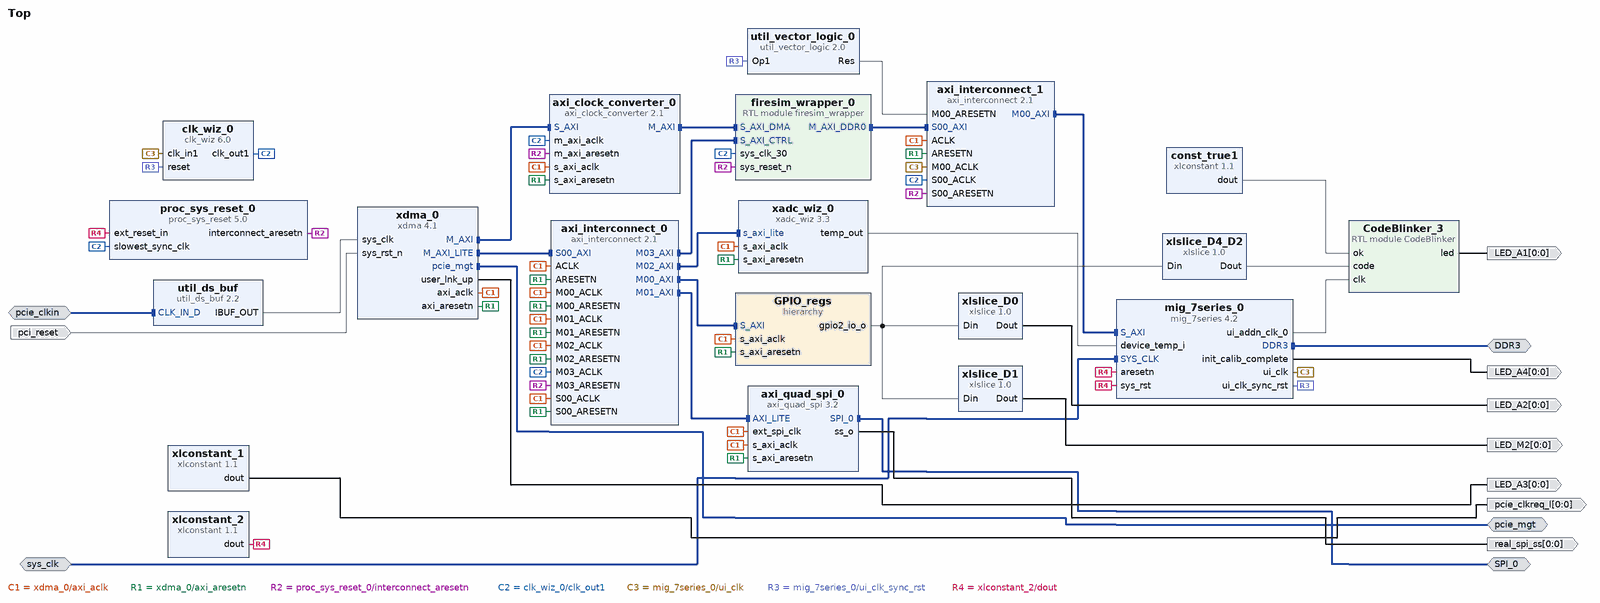
[diagram p0: block diagram of the top level]
# Vivado block design Top, xc7a100tfgg484-2L, Vivado 2023.1
create_bd_design Top

create_bd_intf_port -mode Master -vlnv xilinx.com:interface:ddrx_rtl:1.0 DDR3
create_bd_intf_port -mode Master -vlnv xilinx.com:interface:spi_rtl:1.0 SPI_0
create_bd_intf_port -mode Slave -vlnv xilinx.com:interface:diff_clock_rtl:1.0 pcie_clkin
set_property -dict {CONFIG.FREQ_HZ 100000000} [get_bd_intf_ports pcie_clkin]
create_bd_intf_port -mode Master -vlnv xilinx.com:interface:pcie_7x_mgt_rtl:1.0 pcie_mgt
create_bd_intf_port -mode Slave -vlnv xilinx.com:interface:diff_clock_rtl:1.0 sys_clk
set_property -dict {CONFIG.FREQ_HZ 100000000} [get_bd_intf_ports sys_clk]
create_bd_port -dir O -from 0 -to 0 LED_A4
create_bd_port -dir O -from 0 -to 0 LED_A3
create_bd_port -dir O -from 0 -to 0 real_spi_ss
create_bd_port -dir O -from 0 -to 0 LED_A2
create_bd_port -dir O -from 0 -to 0 LED_A1
create_bd_port -dir I -type rst pci_reset
set_property -dict {CONFIG.POLARITY ACTIVE_LOW} [get_bd_ports pci_reset]
create_bd_port -dir O -from 0 -to 0 pcie_clkreq_l
create_bd_port -dir O -from 0 -to 0 LED_M2

create_bd_cell -type hier GPIO_regs
create_bd_cell -type ip -vlnv xilinx.com:ip:mig_7series:4.2 mig_7series_0
set_property -dict [list \
  CONFIG.BOARD_MIG_PARAM Custom \
  CONFIG.RESET_BOARD_INTERFACE Custom \
  CONFIG.XML_INPUT_FILE mig_b.prj \
] [get_bd_cells mig_7series_0]
create_bd_cell -type ip -vlnv xilinx.com:ip:xlconstant:1.1 xlconstant_1
set_property -dict {CONFIG.CONST_VAL 0} [get_bd_cells xlconstant_1]
create_bd_cell -type ip -vlnv xilinx.com:ip:xlconstant:1.1 xlconstant_2
create_bd_cell -type ip -vlnv xilinx.com:ip:xlslice:1.0 xlslice_D1
set_property -dict {CONFIG.DIN_FROM 1 CONFIG.DIN_TO 1 CONFIG.DIN_WIDTH 32 CONFIG.DOUT_WIDTH 1} [get_bd_cells xlslice_D1]
create_bd_cell -type ip -vlnv xilinx.com:ip:xadc_wiz:3.3 xadc_wiz_0
set_property -dict [list \
  CONFIG.ADC_CONVERSION_RATE 1000 \
  CONFIG.DCLK_FREQUENCY 125 \
  CONFIG.ENABLE_RESET false \
  CONFIG.ENABLE_TEMP_BUS true \
  CONFIG.INTERFACE_SELECTION Enable_AXI \
] [get_bd_cells xadc_wiz_0]
create_bd_cell -type ip -vlnv xilinx.com:ip:util_vector_logic:2.0 util_vector_logic_0
set_property -dict {CONFIG.C_OPERATION not CONFIG.C_SIZE 1} [get_bd_cells util_vector_logic_0]
create_bd_cell -type ip -vlnv xilinx.com:ip:xlconstant:1.1 const_true1
create_bd_cell -type module -reference CodeBlinker CodeBlinker_3
create_bd_cell -type ip -vlnv xilinx.com:ip:xlslice:1.0 xlslice_D0
set_property -dict {CONFIG.DIN_FROM 0 CONFIG.DIN_TO 0 CONFIG.DIN_WIDTH 32 CONFIG.DOUT_WIDTH 1} [get_bd_cells xlslice_D0]
create_bd_cell -type ip -vlnv xilinx.com:ip:xlslice:1.0 xlslice_D4_D2
set_property -dict {CONFIG.DIN_FROM 4 CONFIG.DIN_TO 2 CONFIG.DIN_WIDTH 32 CONFIG.DOUT_WIDTH 3} [get_bd_cells xlslice_D4_D2]
create_bd_cell -type ip -vlnv xilinx.com:ip:axi_interconnect:2.1 axi_interconnect_0
set_property -dict {CONFIG.NUM_MI 4} [get_bd_cells axi_interconnect_0]
create_bd_cell -type ip -vlnv xilinx.com:ip:axi_interconnect:2.1 axi_interconnect_1
set_property -dict {CONFIG.ENABLE_ADVANCED_OPTIONS 0 CONFIG.NUM_MI 1} [get_bd_cells axi_interconnect_1]
create_bd_cell -type ip -vlnv xilinx.com:ip:axi_quad_spi:3.2 axi_quad_spi_0
set_property -dict {CONFIG.C_FIFO_DEPTH 256 CONFIG.C_SPI_MEMORY 3 CONFIG.C_SPI_MODE 2} [get_bd_cells axi_quad_spi_0]
create_bd_cell -type ip -vlnv xilinx.com:ip:util_ds_buf:2.2 util_ds_buf
set_property -dict {CONFIG.C_BUF_TYPE IBUFDSGTE} [get_bd_cells util_ds_buf]
create_bd_cell -type ip -vlnv xilinx.com:ip:xdma:4.1 xdma_0
set_property -dict [list \
  CONFIG.PF0_DEVICE_ID_mqdma 9024 \
  CONFIG.PF0_SRIOV_VF_DEVICE_ID 0000 \
  CONFIG.PF2_DEVICE_ID_mqdma 9024 \
  CONFIG.PF3_DEVICE_ID_mqdma 9024 \
  CONFIG.axi_data_width 128_bit \
  CONFIG.axil_master_64bit_en true \
  CONFIG.axil_master_prefetchable true \
  CONFIG.axilite_master_en true \
  CONFIG.axilite_master_scale Kilobytes \
  CONFIG.axilite_master_size 128 \
  CONFIG.axisten_freq 125 \
  CONFIG.cfg_mgmt_if false \
  CONFIG.copy_pf0 true \
  CONFIG.en_ext_ch_gt_drp false \
  CONFIG.en_pcie_drp false \
  CONFIG.en_transceiver_status_ports false \
  CONFIG.enable_gen4 false \
  CONFIG.mode_selection Advanced \
  CONFIG.pf0_Use_Class_Code_Lookup_Assistant false \
  CONFIG.pf0_base_class_menu Device_was_built_before_Class_Code_definitions_were_finalized \
  CONFIG.pf0_class_code_base 12 \
  CONFIG.pf0_class_code_interface 00 \
  CONFIG.pf0_class_code_sub 00 \
  CONFIG.pf0_device_id 7011 \
  CONFIG.pf0_sub_class_interface_menu All_currently_implemented_devices_except_VGA-compatible_devices \
  CONFIG.pf0_subsystem_id 0 \
  CONFIG.pf0_subsystem_vendor_id 0 \
  CONFIG.pl_link_cap_max_link_speed 5.0_GT/s \
  CONFIG.pl_link_cap_max_link_width X4 \
  CONFIG.plltype QPLL1 \
  CONFIG.runbit_fix false \
  CONFIG.vendor_id 10EE \
  CONFIG.xdma_axi_intf_mm AXI_Memory_Mapped \
  CONFIG.xdma_pcie_64bit_en true \
  CONFIG.xdma_pcie_prefetchable true \
  CONFIG.xdma_rnum_chnl 1 \
  CONFIG.xdma_sts_ports false \
  CONFIG.xdma_wnum_chnl 1 \
] [get_bd_cells xdma_0]
create_bd_cell -type ip -vlnv xilinx.com:ip:axi_clock_converter:2.1 axi_clock_converter_0
set_property -dict {CONFIG.ACLK_ASYNC 1 CONFIG.SYNCHRONIZATION_STAGES 8} [get_bd_cells axi_clock_converter_0]
create_bd_cell -type ip -vlnv xilinx.com:ip:clk_wiz:6.0 clk_wiz_0
set_property -dict [list \
  CONFIG.CLKOUT1_JITTER 247.412 \
  CONFIG.CLKOUT1_PHASE_ERROR 296.868 \
  CONFIG.CLKOUT1_REQUESTED_OUT_FREQ 90.000 \
  CONFIG.MMCM_CLKFBOUT_MULT_F 49.500 \
  CONFIG.MMCM_CLKOUT0_DIVIDE_F 11.000 \
  CONFIG.MMCM_DIVCLK_DIVIDE 5 \
] [get_bd_cells clk_wiz_0]
create_bd_cell -type ip -vlnv xilinx.com:ip:proc_sys_reset:5.0 proc_sys_reset_0
create_bd_cell -type module -reference firesim_wrapper firesim_wrapper_0

# ---- hierarchy /GPIO_regs ----
current_bd_instance /GPIO_regs
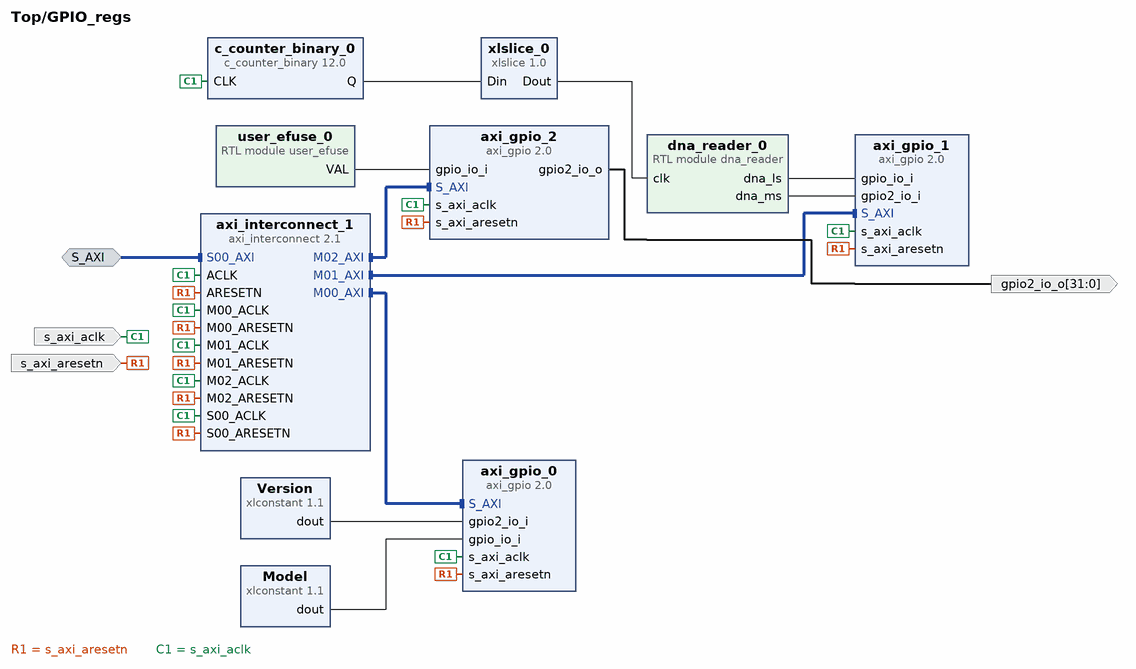
[diagram p1: block diagram inside /GPIO_regs]
create_bd_intf_pin -mode Slave -vlnv xilinx.com:interface:aximm_rtl:1.0 S_AXI
create_bd_pin -dir O -from 31 -to 0 gpio2_io_o
create_bd_pin -dir I -type clk s_axi_aclk
create_bd_pin -dir I -type rst s_axi_aresetn

create_bd_cell -type ip -vlnv xilinx.com:ip:xlconstant:1.1 Model
set_property -dict {CONFIG.CONST_VAL 0x4C495445 CONFIG.CONST_WIDTH 32} [get_bd_cells Model]
create_bd_cell -type ip -vlnv xilinx.com:ip:xlconstant:1.1 Version
set_property -dict {CONFIG.CONST_VAL 0x1 CONFIG.CONST_WIDTH 32} [get_bd_cells Version]
create_bd_cell -type ip -vlnv xilinx.com:ip:xlslice:1.0 xlslice_0
set_property -dict {CONFIG.DIN_FROM 1 CONFIG.DIN_TO 1 CONFIG.DIN_WIDTH 2 CONFIG.DOUT_WIDTH 1} [get_bd_cells xlslice_0]
create_bd_cell -type module -reference dna_reader dna_reader_0
create_bd_cell -type module -reference user_efuse user_efuse_0
create_bd_cell -type ip -vlnv xilinx.com:ip:axi_gpio:2.0 axi_gpio_0
set_property -dict {CONFIG.C_ALL_INPUTS 1 CONFIG.C_ALL_INPUTS_2 1 CONFIG.C_IS_DUAL 1} [get_bd_cells axi_gpio_0]
create_bd_cell -type ip -vlnv xilinx.com:ip:axi_gpio:2.0 axi_gpio_1
set_property -dict {CONFIG.C_ALL_INPUTS 1 CONFIG.C_ALL_INPUTS_2 1 CONFIG.C_IS_DUAL 1} [get_bd_cells axi_gpio_1]
create_bd_cell -type ip -vlnv xilinx.com:ip:axi_gpio:2.0 axi_gpio_2
set_property -dict [list \
  CONFIG.C_ALL_INPUTS 1 \
  CONFIG.C_ALL_INPUTS_2 0 \
  CONFIG.C_ALL_OUTPUTS_2 1 \
  CONFIG.C_DOUT_DEFAULT_2 0x0000000C \
  CONFIG.C_IS_DUAL 1 \
] [get_bd_cells axi_gpio_2]
create_bd_cell -type ip -vlnv xilinx.com:ip:axi_interconnect:2.1 axi_interconnect_1
set_property -dict {CONFIG.ENABLE_ADVANCED_OPTIONS 0 CONFIG.NUM_MI 3} [get_bd_cells axi_interconnect_1]
create_bd_cell -type ip -vlnv xilinx.com:ip:c_counter_binary:12.0 c_counter_binary_0
set_property -dict {CONFIG.Output_Width 2} [get_bd_cells c_counter_binary_0]

# ---- connections ----

current_bd_instance /GPIO_regs
connect_bd_intf_net [get_bd_intf_pins S_AXI] [get_bd_intf_pins axi_interconnect_1/S00_AXI]
connect_bd_intf_net [get_bd_intf_pins axi_gpio_0/S_AXI] [get_bd_intf_pins axi_interconnect_1/M00_AXI]
connect_bd_intf_net [get_bd_intf_pins axi_gpio_1/S_AXI] [get_bd_intf_pins axi_interconnect_1/M01_AXI]
connect_bd_intf_net [get_bd_intf_pins axi_gpio_2/S_AXI] [get_bd_intf_pins axi_interconnect_1/M02_AXI]
connect_bd_net -net S00_ARESETN_1 [get_bd_pins s_axi_aresetn] \
  [get_bd_pins axi_gpio_0/s_axi_aresetn] [get_bd_pins axi_gpio_1/s_axi_aresetn] [get_bd_pins axi_gpio_2/s_axi_aresetn] \
  [get_bd_pins axi_interconnect_1/ARESETN] [get_bd_pins axi_interconnect_1/S00_ARESETN] \
  [get_bd_pins axi_interconnect_1/M00_ARESETN] [get_bd_pins axi_interconnect_1/M01_ARESETN] \
  [get_bd_pins axi_interconnect_1/M02_ARESETN]
connect_bd_net [get_bd_pins Version/dout] [get_bd_pins axi_gpio_0/gpio2_io_i]
connect_bd_net [get_bd_pins axi_gpio_2/gpio2_io_o] [get_bd_pins gpio2_io_o]
connect_bd_net [get_bd_pins c_counter_binary_0/Q] [get_bd_pins xlslice_0/Din]
connect_bd_net [get_bd_pins dna_reader_0/dna_ls] [get_bd_pins axi_gpio_1/gpio_io_i]
connect_bd_net [get_bd_pins dna_reader_0/dna_ms] [get_bd_pins axi_gpio_1/gpio2_io_i]
connect_bd_net [get_bd_pins s_axi_aclk] \
  [get_bd_pins axi_gpio_0/s_axi_aclk] [get_bd_pins axi_gpio_1/s_axi_aclk] [get_bd_pins axi_gpio_2/s_axi_aclk] \
  [get_bd_pins axi_interconnect_1/ACLK] [get_bd_pins axi_interconnect_1/S00_ACLK] [get_bd_pins axi_interconnect_1/M00_ACLK] \
  [get_bd_pins axi_interconnect_1/M01_ACLK] [get_bd_pins axi_interconnect_1/M02_ACLK] [get_bd_pins c_counter_binary_0/CLK]
connect_bd_net [get_bd_pins user_efuse_0/VAL] [get_bd_pins axi_gpio_2/gpio_io_i]
connect_bd_net -net xlconstant_3_dout [get_bd_pins Model/dout] [get_bd_pins axi_gpio_0/gpio_io_i]
connect_bd_net [get_bd_pins xlslice_0/Dout] [get_bd_pins dna_reader_0/clk]

current_bd_instance /
connect_bd_intf_net [get_bd_intf_pins axi_clock_converter_0/M_AXI] [get_bd_intf_pins firesim_wrapper_0/S_AXI_DMA]
connect_bd_intf_net [get_bd_intf_pins GPIO_regs/S_AXI] [get_bd_intf_pins axi_interconnect_0/M00_AXI]
connect_bd_intf_net [get_bd_intf_pins axi_interconnect_0/M01_AXI] [get_bd_intf_pins axi_quad_spi_0/AXI_LITE]
connect_bd_intf_net [get_bd_intf_pins axi_interconnect_0/M02_AXI] [get_bd_intf_pins xadc_wiz_0/s_axi_lite]
connect_bd_intf_net [get_bd_intf_pins axi_interconnect_0/M03_AXI] [get_bd_intf_pins firesim_wrapper_0/S_AXI_CTRL]
connect_bd_intf_net [get_bd_intf_pins axi_interconnect_1/M00_AXI] [get_bd_intf_pins mig_7series_0/S_AXI]
connect_bd_intf_net [get_bd_intf_ports SPI_0] [get_bd_intf_pins axi_quad_spi_0/SPI_0]
connect_bd_intf_net -intf_net diff_clock_rtl_0_1 [get_bd_intf_ports pcie_clkin] [get_bd_intf_pins util_ds_buf/CLK_IN_D]
connect_bd_intf_net -intf_net diff_clock_rtl_1_1 [get_bd_intf_ports sys_clk] [get_bd_intf_pins mig_7series_0/SYS_CLK]
connect_bd_intf_net [get_bd_intf_pins firesim_wrapper_0/M_AXI_DDR0] [get_bd_intf_pins axi_interconnect_1/S00_AXI]
connect_bd_intf_net [get_bd_intf_ports DDR3] [get_bd_intf_pins mig_7series_0/DDR3]
connect_bd_intf_net [get_bd_intf_pins xdma_0/M_AXI] [get_bd_intf_pins axi_clock_converter_0/S_AXI]
connect_bd_intf_net [get_bd_intf_pins axi_interconnect_0/S00_AXI] [get_bd_intf_pins xdma_0/M_AXI_LITE]
connect_bd_intf_net [get_bd_intf_ports pcie_mgt] [get_bd_intf_pins xdma_0/pcie_mgt]
connect_bd_net [get_bd_pins CodeBlinker_3/led] [get_bd_ports LED_A1]
connect_bd_net [get_bd_pins GPIO_regs/gpio2_io_o] [get_bd_pins xlslice_D1/Din] [get_bd_pins xlslice_D0/Din] [get_bd_pins xlslice_D4_D2/Din]
connect_bd_net -net M00_ARESETN_1 [get_bd_pins util_vector_logic_0/Res] [get_bd_pins axi_interconnect_1/M00_ARESETN]
connect_bd_net -net S00_ACLK_1 [get_bd_pins xdma_0/axi_aclk] \
  [get_bd_pins GPIO_regs/s_axi_aclk] [get_bd_pins xadc_wiz_0/s_axi_aclk] [get_bd_pins axi_interconnect_0/ACLK] \
  [get_bd_pins axi_interconnect_0/S00_ACLK] [get_bd_pins axi_interconnect_0/M00_ACLK] \
  [get_bd_pins axi_interconnect_0/M01_ACLK] [get_bd_pins axi_interconnect_0/M02_ACLK] [get_bd_pins axi_interconnect_1/ACLK] \
  [get_bd_pins axi_quad_spi_0/ext_spi_clk] [get_bd_pins axi_quad_spi_0/s_axi_aclk] \
  [get_bd_pins axi_clock_converter_0/s_axi_aclk]
connect_bd_net -net S00_ARESETN_1 [get_bd_pins xdma_0/axi_aresetn] \
  [get_bd_pins GPIO_regs/s_axi_aresetn] [get_bd_pins xadc_wiz_0/s_axi_aresetn] [get_bd_pins axi_interconnect_0/ARESETN] \
  [get_bd_pins axi_interconnect_0/S00_ARESETN] [get_bd_pins axi_interconnect_0/M00_ARESETN] \
  [get_bd_pins axi_interconnect_0/M01_ARESETN] [get_bd_pins axi_interconnect_0/M02_ARESETN] \
  [get_bd_pins axi_interconnect_1/ARESETN] [get_bd_pins axi_quad_spi_0/s_axi_aresetn] \
  [get_bd_pins axi_clock_converter_0/s_axi_aresetn]
connect_bd_net -net S00_ARESETN_2 [get_bd_pins proc_sys_reset_0/interconnect_aresetn] \
  [get_bd_pins axi_interconnect_1/S00_ARESETN] [get_bd_pins axi_interconnect_0/M03_ARESETN] \
  [get_bd_pins firesim_wrapper_0/sys_reset_n] [get_bd_pins axi_clock_converter_0/m_axi_aresetn]
connect_bd_net [get_bd_pins axi_quad_spi_0/ss_o] [get_bd_ports real_spi_ss]
connect_bd_net [get_bd_pins clk_wiz_0/clk_out1] \
  [get_bd_pins proc_sys_reset_0/slowest_sync_clk] [get_bd_pins axi_interconnect_1/S00_ACLK] \
  [get_bd_pins axi_interconnect_0/M03_ACLK] [get_bd_pins firesim_wrapper_0/sys_clk_30] \
  [get_bd_pins axi_clock_converter_0/m_axi_aclk]
connect_bd_net [get_bd_pins const_true1/dout] [get_bd_pins CodeBlinker_3/ok]
connect_bd_net [get_bd_pins mig_7series_0/init_calib_complete] [get_bd_ports LED_A4]
connect_bd_net [get_bd_pins mig_7series_0/ui_addn_clk_0] [get_bd_pins CodeBlinker_3/clk]
connect_bd_net [get_bd_pins mig_7series_0/ui_clk] [get_bd_pins axi_interconnect_1/M00_ACLK] [get_bd_pins clk_wiz_0/clk_in1]
connect_bd_net [get_bd_pins mig_7series_0/ui_clk_sync_rst] [get_bd_pins util_vector_logic_0/Op1] [get_bd_pins clk_wiz_0/reset]
connect_bd_net [get_bd_ports pci_reset] [get_bd_pins xdma_0/sys_rst_n]
connect_bd_net [get_bd_pins util_ds_buf/IBUF_OUT] [get_bd_pins xdma_0/sys_clk]
connect_bd_net -net xadc_wiz_1_temp_out [get_bd_pins xadc_wiz_0/temp_out] [get_bd_pins mig_7series_0/device_temp_i]
connect_bd_net [get_bd_pins xdma_0/user_lnk_up] [get_bd_ports LED_A3]
connect_bd_net [get_bd_pins xlconstant_1/dout] [get_bd_ports pcie_clkreq_l]
connect_bd_net [get_bd_pins xlconstant_2/dout] \
  [get_bd_pins mig_7series_0/sys_rst] [get_bd_pins mig_7series_0/aresetn] [get_bd_pins proc_sys_reset_0/ext_reset_in]
connect_bd_net -net xlslice_0_Dout [get_bd_pins xlslice_D1/Dout] [get_bd_ports LED_M2]
connect_bd_net -net xlslice_2_Dout [get_bd_pins xlslice_D4_D2/Dout] [get_bd_pins CodeBlinker_3/code]
connect_bd_net [get_bd_pins xlslice_D0/Dout] [get_bd_ports LED_A2]

# ---- address map ----
assign_bd_address -offset 0x080000000 -range 512M -target_address_space [get_bd_addr_spaces firesim_wrapper_0/M_AXI_DDR0] [get_bd_addr_segs mig_7series_0/memmap/memaddr]
assign_bd_address -offset 0x0000000000000000 -range 16E -target_address_space [get_bd_addr_spaces xdma_0/M_AXI] [get_bd_addr_segs firesim_wrapper_0/S_AXI_DMA/reg0]
assign_bd_address -offset 0x00000000 -range 4G -target_address_space [get_bd_addr_spaces xdma_0/M_AXI_LITE] [get_bd_addr_segs firesim_wrapper_0/S_AXI_CTRL/reg0]

validate_bd_design
save_bd_design
